# EAGLE design robo2 (EAGLE 9.0.1)
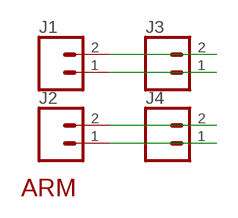
[diagram p0: schematic, sheet 1]

## Parts
J1  CONN_02LOCK  [1X02_LOCK]
J2  CONN_02LOCK  [1X02_LOCK]
J3  CONN_02LOCK  [1X02_LOCK]
J4  CONN_02LOCK  [1X02_LOCK]
U$1  ARMROBO2  [ROBO2]

## Nets
V1: J1.1 J3.1
V2: J1.2 J3.2
V3: J2.1 J4.1
V4: J2.2 J4.2

## Library data of the parts
J1-J4 = SparkFun-Connectors:CONN_02: Multi connection point. Often used as Generic Header-pin footprint for 0.1 inch spaced/style header connections On any of the 0.1 inch spaced packages, you can populate with these: Break Away Headers - Straight <https://www.sparkfun.com/products/116> (PRT-00116) Break Away Male Headers - Right Angle <https://www.sparkfun.com/products/553> (PRT-00553) Female Headers <https://www.sparkfun.com/products/115> (PRT-00115) Break Away Headers - Machine Pin <https://www.sparkfun.com/products/117> (PRT-00117) Break Away Female Headers - Swiss Machine Pin <https://www.sparkfun.com/products/743> (PRT-00743) For SCREWTERMINALS and SPRING TERMINALS visit here: Screw Terimnals on SparkFun.com <https://www.sparkfun.com/search/results?term=Screw+Terminals> (5mm/3.5mm/2.54mm spacing) This device is also useful as a general connection point to wire up your design to another part of your project. Our various solder wires solder well into these plated through hole pads. Hook-Up Wire - Assortment (Stranded, 22 AWG) <https://www.sparkfun.com/products/11375> (PRT-11375) Hook-Up Wire - Assortment (Solid Core, 22 AWG) <https://www.sparkfun.com/products/11367> (PRT-11367) View the entire wire category on our website here <https://www.sparkfun.com/categories/141> Special notes: Molex polarized connector foot print use with: PRT-08233 with associated crimp pins and housings. 2.54_SCREWTERM for use with PRT-10571. 3.5mm Screw Terminal footprints for PRT-08084 5mm Screw Terminal footprints for use with PRT-08432
U$1 = arms:ARM

## Board
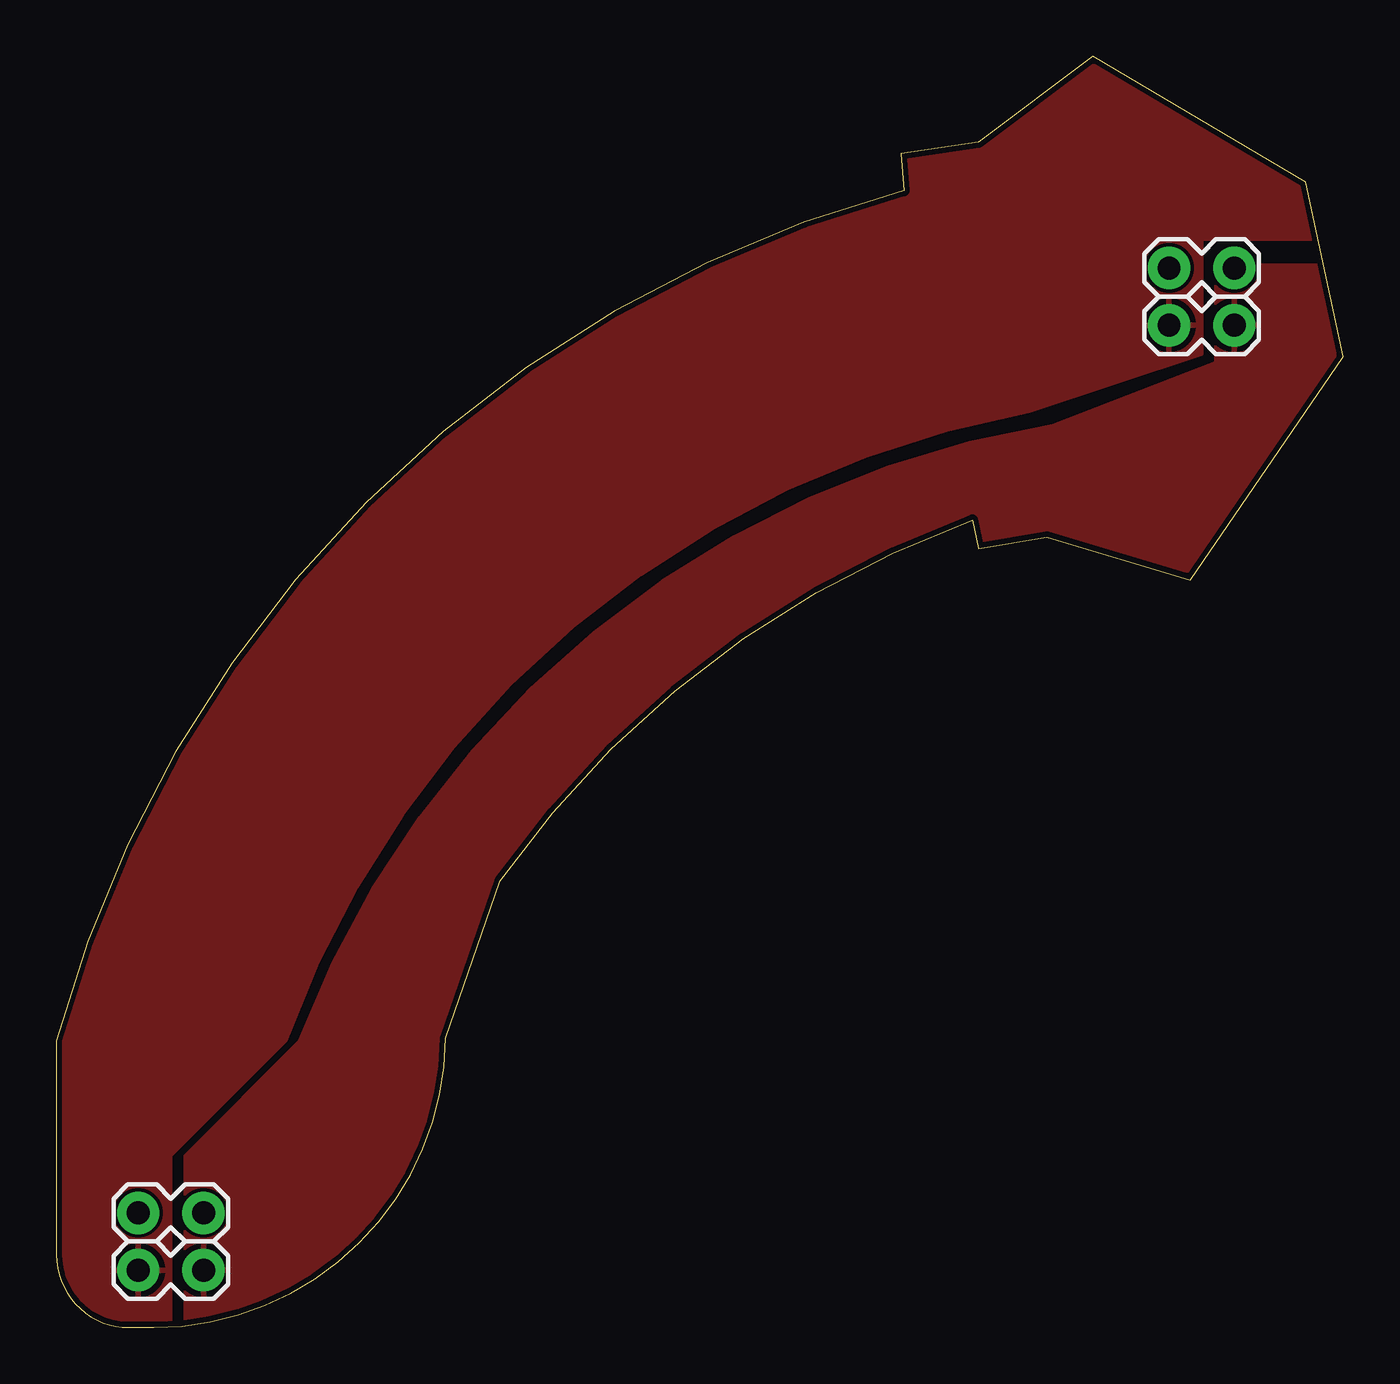
[diagram p1: board, top side]
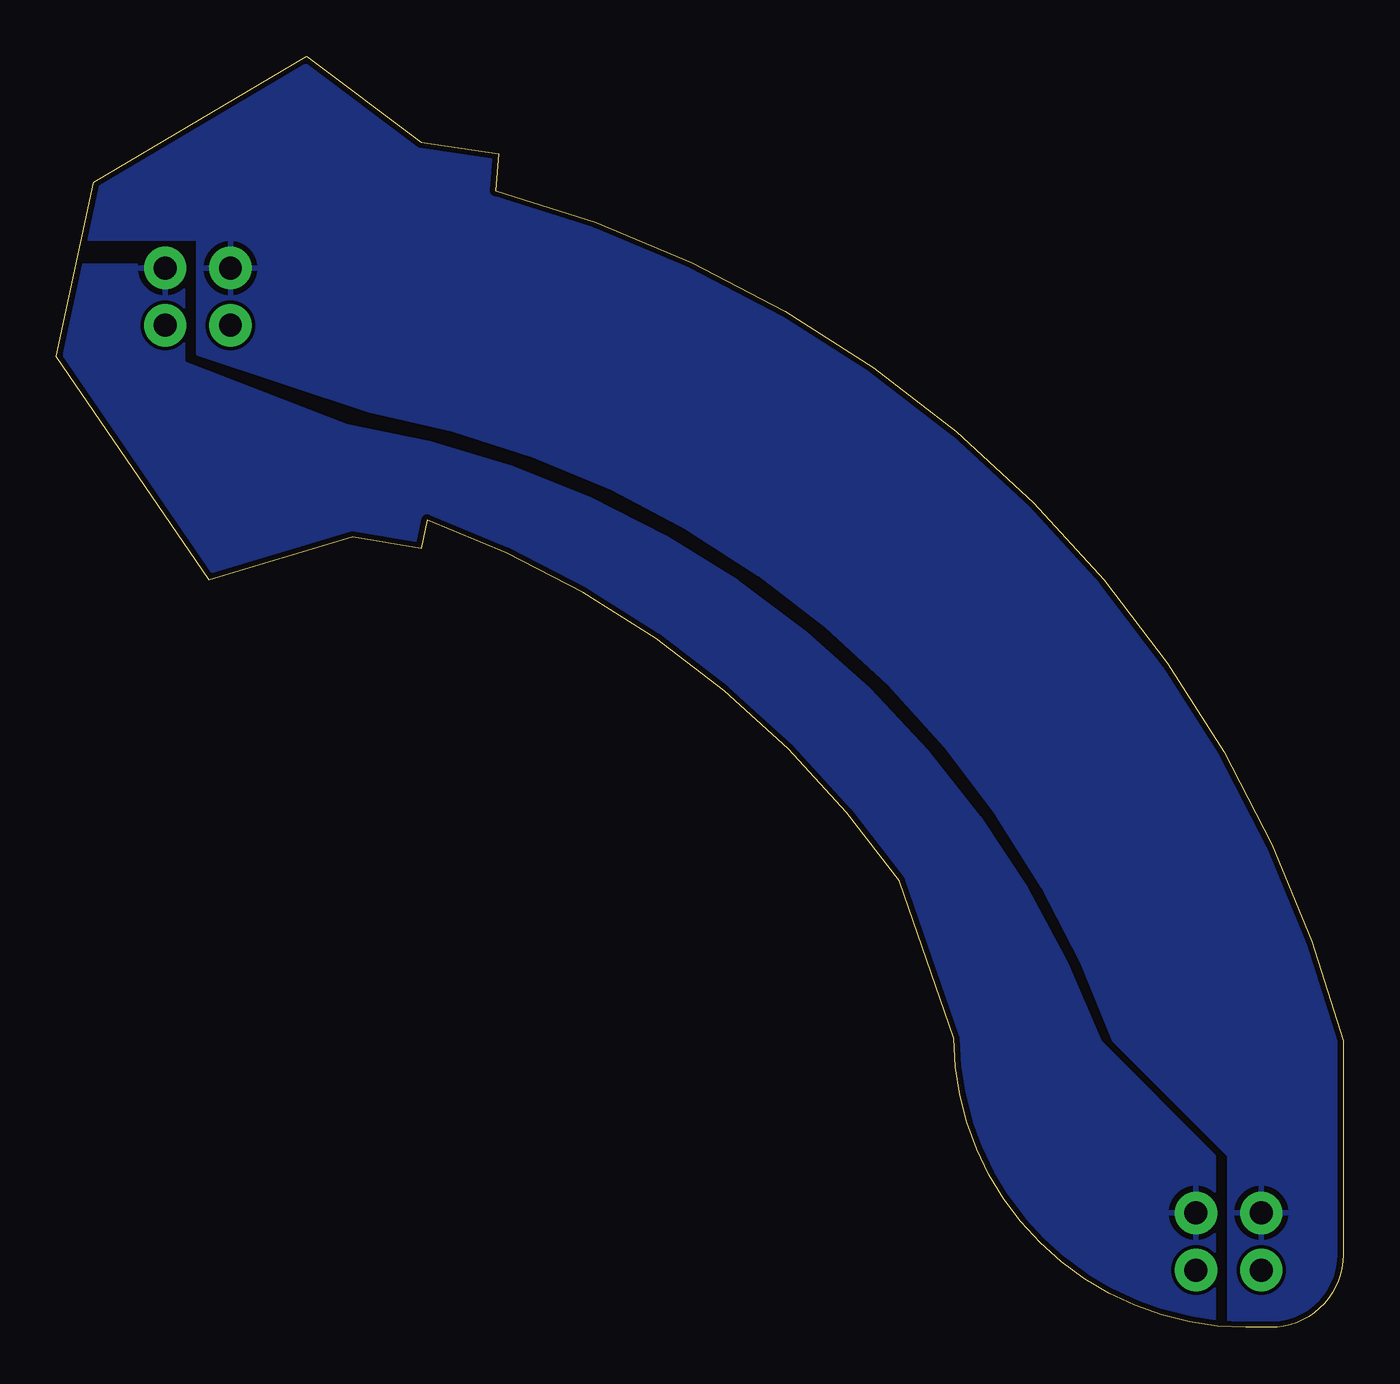
[diagram p2: board, bottom side, seen from below]

Size 57.07 x 56.38 mm. Coordinates in mm from the lower left corner, seen from the top.
Outline: 0,12.7 0,3.23 arc90 3.23,0 4.32,0 arc89 17.27,12.83 19.68,19.81 arc-35 40.64,35.81 40.89,34.54 43.94,35.05 50.29,33.15 57.07,43.05 55.42,50.79 45.97,56.38 40.89,52.58 37.47,52.07 37.59,50.42 arc60 0,12.7
Copper layers (1*16): Top 0.035mm / dielectric 1.5mm / Bottom 0.035mm
Design rules "default *": minimum track width 6mil, minimum drill 0.35mm, track to track 6mil, track to pad 6mil, pad to pad 6mil, via to via 6mil, smd to smd 6mil, copper to edge 10mil, drill to drill 6mil, minimum pad ring 10mil, minimum via ring 8mil, stop-mask expansion 4mil, vias tented up to drill 0mil, thermal gap 10mil

### Footprints (pad centres in the part's own frame; a part is rotated, then mirrored left to right if it is on the bottom)
1X02_LOCK = drill 1.016 pad 1.88: 1 -0.178,0; 2 2.718,0

### Placement (x,y rotation side)
J1  49.53,44.45 0 top
J2  49.53,46.99 0 top
J3  3.81,2.54 0 top
J4  3.81,5.08 0 top
U$1  1.27,12.7 0 top

### Tracks (layer width: path | path; a pad name or v marks a point on that pad's centre or on a via)
V1
  pour Top: 0,0 5.08,0 5.08,7.62 10.16,12.7 arc-60 43.18,40.64 50.8,43.18 50.8,48.26 57.15,48.26 57.15,57.15 0,57.15
V2
  pour Top: 63.5,0 5.71,0 5.71,7.62 10.79,12.7 arc-60 44.2,40.01 51.44,42.8 51.44,47.12 57.78,47.12 57.78,57.15 63.5,57.15
V3
  pour Bottom: 0,0 5.08,0 5.08,7.62 10.16,12.7 arc-60 43.18,40.64 50.8,43.18 50.8,48.26 57.15,48.26 57.15,57.15 0,57.15
V4
  pour Bottom: 63.5,0 5.71,0 5.71,7.62 10.79,12.7 arc-60 44.2,40.01 51.44,42.8 51.44,47.12 57.78,47.12 57.78,57.15 63.5,57.15

### Text on the board
tStop: by / @securelyfitz / git.io/sao-arms